# EAGLE schematic foxbms_bms-master_basic_v1.00 (EAGLE 6.5.0), part 2 of 2
## Sheet 22 of 22: Basic to Extension Connector
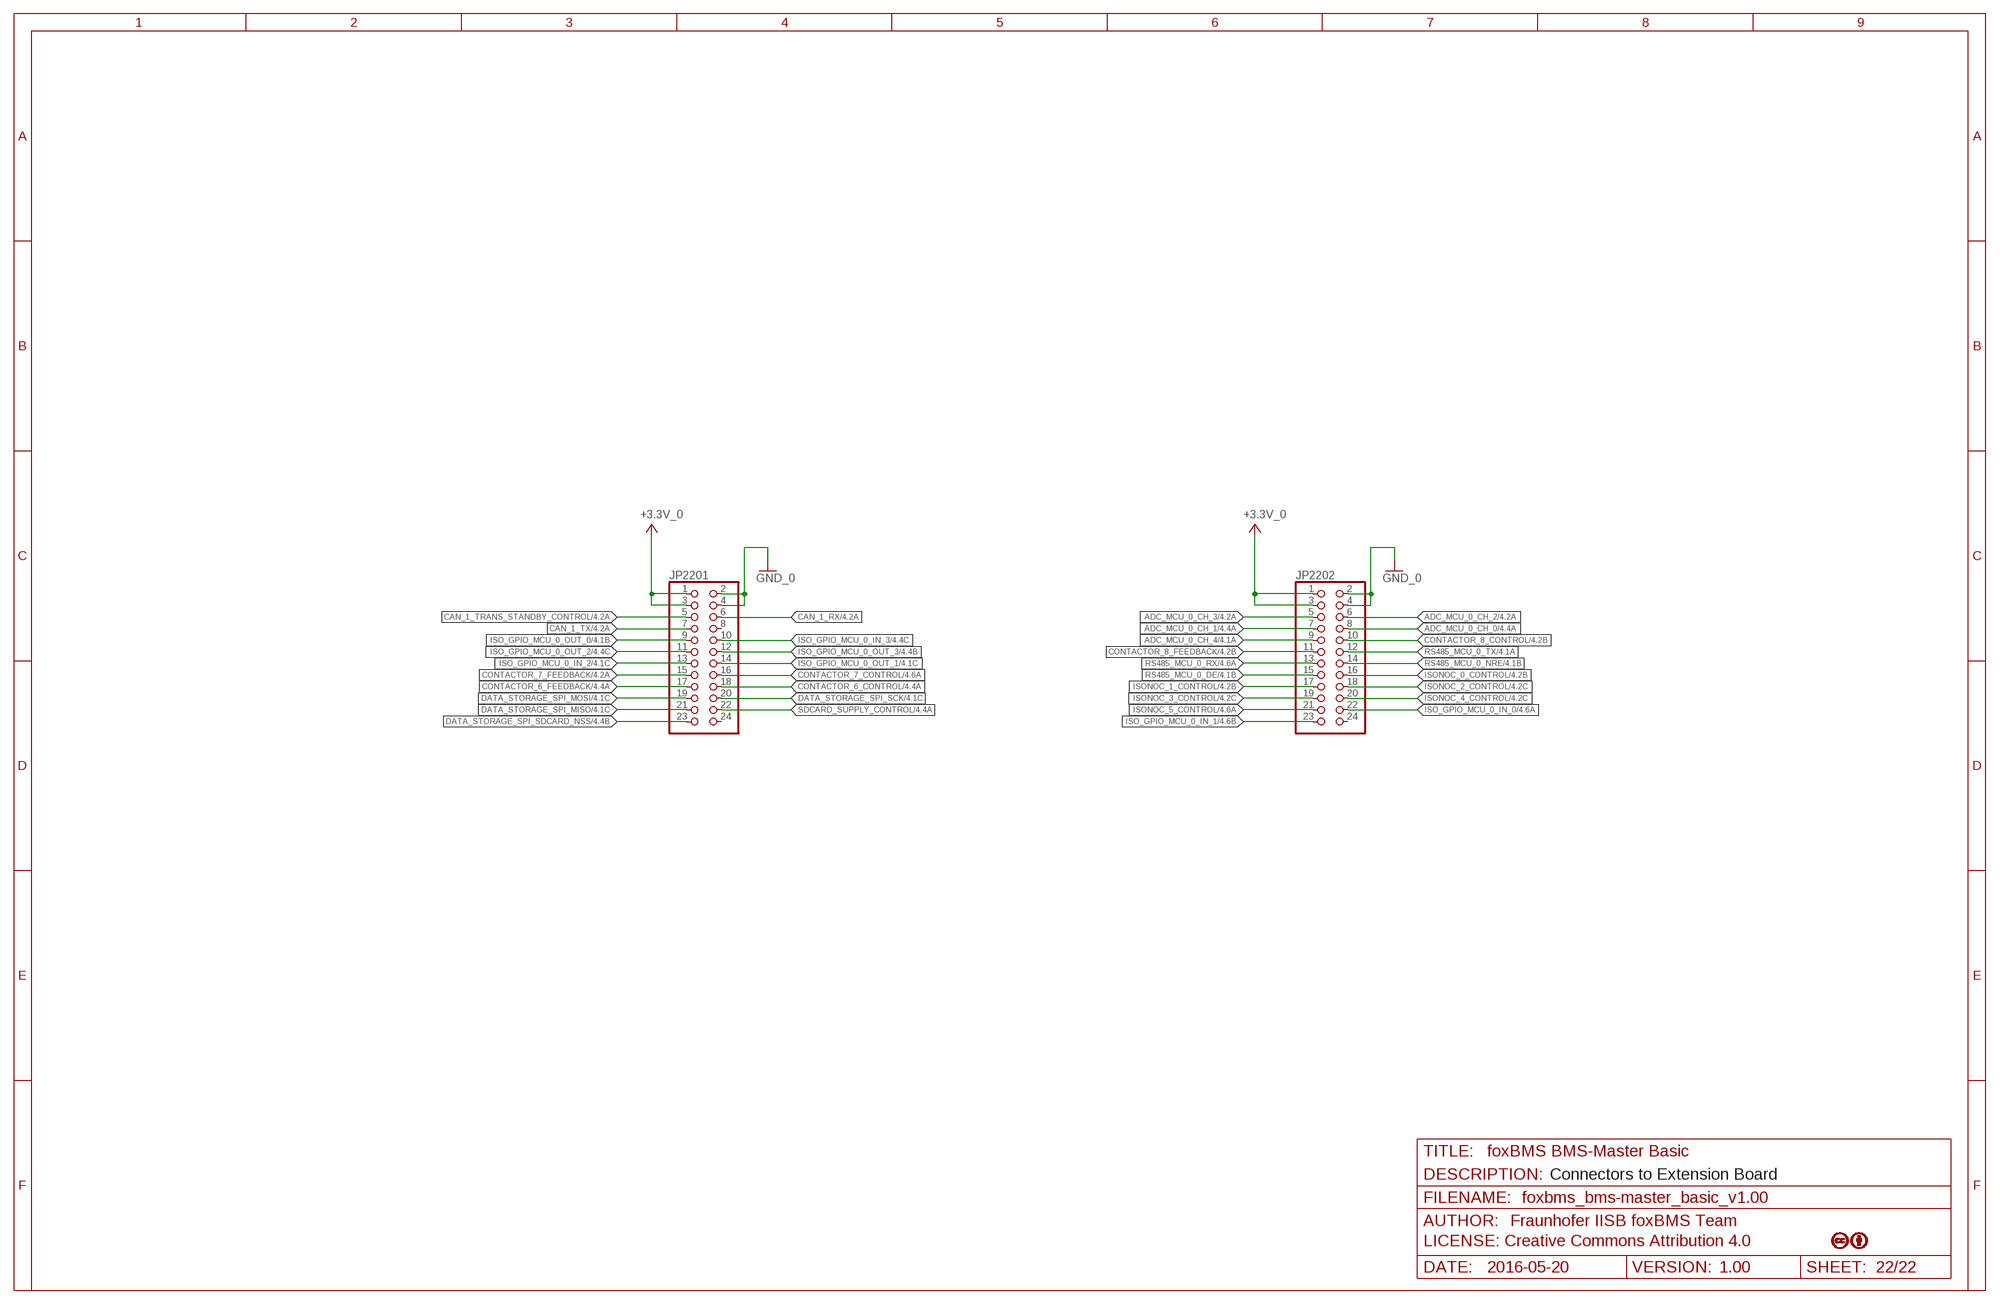
[diagram p21: schematic, sheet 22]

### Parts
JP2201  PINHD-2X12  [2X12]
JP2202  PINHD-2X12  [2X12]

### Nets
+3.3V_0: JP2201.1 JP2201.3 JP2202.1 JP2202.3 ; also sheet 2,4,6,7,8,9,10,11,14,15,16,18,21
ADC_MCU_0_CH_0: JP2202.8 ; also sheet 4
ADC_MCU_0_CH_1: JP2202.7 ; also sheet 4
ADC_MCU_0_CH_2: JP2202.6 ; also sheet 4
ADC_MCU_0_CH_3: JP2202.5 ; also sheet 4
ADC_MCU_0_CH_4: JP2202.9 ; also sheet 4
CAN_1_RX: JP2201.6 ; also sheet 4
CAN_1_TRANS_STANDBY_CONTROL: JP2201.5 ; also sheet 4
CAN_1_TX: JP2201.7 ; also sheet 4
CONTACTOR_6_CONTROL: JP2201.18 ; also sheet 4
CONTACTOR_6_FEEDBACK: JP2201.17 ; also sheet 4
CONTACTOR_7_CONTROL: JP2201.16 ; also sheet 4
CONTACTOR_7_FEEDBACK: JP2201.15 ; also sheet 4
CONTACTOR_8_CONTROL: JP2202.10 ; also sheet 4
CONTACTOR_8_FEEDBACK: JP2202.11 ; also sheet 4
DATA_STORAGE_SPI_MISO [controller]: JP2201.21 ; also sheet 4,15
DATA_STORAGE_SPI_MOSI [controller]: JP2201.19 ; also sheet 4,15
DATA_STORAGE_SPI_SCK [controller]: JP2201.20 ; also sheet 4,15
DATA_STORAGE_SPI_SDCARD_NSS: JP2201.23 ; also sheet 4
GND_0: JP2201.2 JP2201.4 JP2202.2 JP2202.4 ; also sheet 2,4,6,7,8,9,10,11,14,15,16,18,21
ISO_GPIO_MCU_0_IN_0: JP2202.22 ; also sheet 4
ISO_GPIO_MCU_0_IN_1: JP2202.23 ; also sheet 4
ISO_GPIO_MCU_0_IN_2: JP2201.13 ; also sheet 4
ISO_GPIO_MCU_0_IN_3: JP2201.10 ; also sheet 4
ISO_GPIO_MCU_0_OUT_0: JP2201.9 ; also sheet 4
ISO_GPIO_MCU_0_OUT_1: JP2201.14 ; also sheet 4
ISO_GPIO_MCU_0_OUT_2: JP2201.11 ; also sheet 4
ISO_GPIO_MCU_0_OUT_3: JP2201.12 ; also sheet 4
ISONOC_0_CONTROL: JP2202.16 ; also sheet 4
ISONOC_1_CONTROL: JP2202.17 ; also sheet 4
ISONOC_2_CONTROL: JP2202.18 ; also sheet 4
ISONOC_3_CONTROL: JP2202.19 ; also sheet 4
ISONOC_4_CONTROL: JP2202.20 ; also sheet 4
ISONOC_5_CONTROL: JP2202.21 ; also sheet 4
RS485_MCU_0_DE: JP2202.15 ; also sheet 4
RS485_MCU_0_NRE: JP2202.14 ; also sheet 4
RS485_MCU_0_RX: JP2202.13 ; also sheet 4
RS485_MCU_0_TX: JP2202.12 ; also sheet 4
SDCARD_SUPPLY_CONTROL: JP2201.22 ; also sheet 4
Unconnected: JP2201.8 JP2201.24 JP2202.24

### Notes on the sheet
- Connectors to Extension Board

## Library data of the parts
BATT = 0_LES_MECHANIK.SMD:SM?*: SM-Serie - Renata Batteries SMTU357-LF: Datasheet www Datasheet local SMTU1220-LF: Datasheet www Datasheet local SMTU1225-LF: Datasheet www Datasheet local Battery-Holder - Holder material: heat-resistant, glass fibre filled LCP Flammability rating UL 94 V-O - Battery contacts: spring stainless steel AISI 301, nickel-plated throughout. Solder area tin-plated throughout, min. thickness 5μm. - Contact resistance between contacts and the cell is less than 100 mΩ (measured through AC 1kHz; depending on the case material of the cell). - UL recognition, file E218732 - Operating temperature range: - 40/+100°C Revision Date changed by Changes ------------------------------------------------------------------------------------------ V1.0 08.12.2015 SC Ersterstellung; DISTRI_1: Farnell; DISTRI_1-NR: 1216353; DISTRI_1-PREIS: 1,52€; DISTRI_2: Mouser; DISTRI_2-NR: 614-SMTU1225-LF; DISTRI_2-PREIS: 0,864€; HERSTELLER: Renata; HERSTELLER-NR: SMTU1225-LF; MARKING: SMTU1225-LF; PDF-LOCAL: file:///C:\Eagle-Datasheet\Mechanik\SMTU1225-LF_Renata.pdf; SIZE: 23,70mm x 12,50mm x 4,80mm; UKAT: I; UTERM: Sn; UTMAX: 100°C; UTMIN: -40°C; UTYP: Battery Holder; UVAL: SMTU1225-LF
C201-C208 C301-C308 C401-C430 C501-C513 C601 C602 C701-C707 C901 C902 C1101-C1107 C1401-C1410 C1601-C1604 C1801-C1807 C2101 C2102 = rcl:C-EU: CAPACITOR, European symbol
C801-C807 C1501 = custom_passiv:C*: Kondensator Bitte gleich beim Einfügen vorgesehenen Werkstoff auswählen. 0402 NP0: #2759 0402 X7R: #1977 0402 Y5V: #2761 0603 X7R: #191 0603 Y5V: #497 0805 NP0: #74 0805 X7R: #104 1206 NP0: #102 1206 X7R: #98 1210 X7R: #114 1812 X7R: #335
D201 D301 = 0_LES_DIODE.SMD.SCHOTTKY:VS-10BQ*?: VS-10BQ Serie - Vishay VS-10BQ015-M3: Datasheet www Datasheet local VS-10BQ015HM3: Datasheet www Datasheet local VS-10BQ030-M3: Datasheet www Datasheet local VS-10BQ030HM3: Datasheet www Datasheet local VS-10BQ040-M3: Datasheet www Datasheet local VS-10BQ040HM3: Datasheet www Datasheet local VS-10BQ060-M3: Datasheet www Datasheet local VS-10BQ060HM3: Datasheet www Datasheet local VS-10BQ100-M3: Datasheet www Datasheet local VS-10BQ100HM3: Datasheet www Datasheet local High-Voltage Surface Mount Schottky Rectifier, 1A - Low forward voltage drop - Guard ring for enhanced ruggedness and long term reliability - Small foot print, surface mountable Revision Date changed by Changes ------------------------------------------------------------------------------------------ V1.0 21.04.2016 SC Ersterstellung; DISTRI_1: Mouser; DISTRI_1-NR: 78-VS-10BQ040-M35BT; DISTRI_1-PREIS: 0,398€; DISTRI_2: Digi-Key; DISTRI_2-NR: VS-10BQ040-M3/5BT-ND; DISTRI_2-PREIS: 0,405€; HERSTELLER: Vishay; HERSTELLER-NR: VS-10BQ040-M3; MARKING: 1F; PDF-LOCAL: file:///C:\Eagle-Datasheet\Dioden\VS-10BQ015-M3_Vishay.pdf; SIZE: SMB (DO-214AA); UIF: 1,00A; UKAT: I; UTERM: Sn; UTMAX: 175°C; UTMIN: -55°C; UTYP: Schottky; UVAL: VS-10BQ040-M3; UVR: 40,0V
D701 D702 = custom_diode:MM3Z_XVX_T1: MM3Z_xVx_T1 Series Zener Diode
D801 = 0_LES_TVS.SMD.ARRAY:PESD: DESD-Serie - NXP PESD1CAN-U: Datasheet www Datasheet local PESD1CAN: Datasheet www Datasheet local PESD1FLEX: Datasheet www Datasheet local PESD1IVN-U: Datasheet www Datasheet local PESD1LIN: Datasheet www Datasheet local PESD2CAN: Datasheet www Datasheet local PESD2IVN-U: Datasheet www Datasheet local TVS - Protection Diode - One very small SOT323 package to protect two CAN bus lines - Low clamping voltage VCL = 35 V at IPP = 1 A - Typical diode capacitance matching ΔCd/Cd = 0.1 % - ESD protection up to 23 kV; IEC 61000-4-2, level 4 - IEC 61000-4-5 (surge); IPPM = 3 A at tp = 8/20 μs - AEC-Q101 qualified Revision Date changed by Changes ------------------------------------------------------------------------------------------ V1.0 16.12.2015 SC Ersterstellung PESD1CAN-U V1.0 21.04.2016 SC Erstellung PESD1CAN; DISTRI_1: Farnell; DISTRI_1-NR: 1510703; DISTRI_1-PREIS: 0,086€; DISTRI_2: Mouser; DISTRI_2-NR: 771-PESD1CAN-T/R; DISTRI_2-PREIS: 0,416€; HERSTELLER: NXP; HERSTELLER-NR: PESD1CAN; MARKING: *AN; PDF-LOCAL: file:///C:\Eagle-Datasheet\TVS\PESD1CAN_NXP.pdf; SIZE: SOT23; UKAT: I; UTERM: Sn; UTMAX: 150°C; UTMIN: -55°C; UTYP: ESD Protection; UVAL: PESD1CAN; UVCC_MAX: 70,0V
D901 D902 = foxBMS_BMS-Master_V1.00_A:MM3Z_XVX_T1: MM3Z_xVx_T1 Series Zener Diode
D1001-D1006 = diode:GF1: DIODE
D1101-D1106 = 0_LES_TVS.SMD.ARRAY:CDSOD323-T*?: CDSOD323-TxxX - Bourns (unidirectional) Datasheet www Datasheet local Transient Voltage Suppressor Array diodes - Case: SOD323 - RoHS compliant* - Protects one line or one I/O port - Bidirectional configuration - ESD protection 30 kV max. - Low capacitance: ~3 pF typical - Replaces 0805 MLV devices Revision Date changed by Changes ------------------------------------------------------------------------------------------ V1.0 02.05.2016 SC Ersterstellung; HERSTELLER: BOURNS; HERSTELLER-NR: CDSOD323-T05; MARKING: 5; PDF-LOCAL: file:///C:/Eagle-Datasheet/TVS/CDSOD323-TxxC_Bourns.pdf; SIZE: SOD323 (SC-76); UID: 5,00uA; UKAT: I; UTERM: Sn; UTMAX: 150°C; UTMIN: -55°C; UTYP: TVS; UVAL: CDSOD323-T05; UVBR: 6,00V; UVCC: 5,00V
F1001-F1006 = 0_LES_SICHERUNG.SMD:*_UMT: UMT-Serie - Schurter Electronic Components Datasheet www Datasheet local Nicht Rückstellende Sicherung - 2-Pin OMT (11,00mm x 3,00mm x 3,00mm) Package - Nennspannung: 125 - 250VAC, 125 VDC - Nennstrom: 0.08 - 10A - Ausschaltvermögen: 35A - 200A - Charakteristik: Träge T - Montage: Leiterplatte,SMT - Zulässige Umgebungstemp: -55°C bis 125°C - Klimakategorie: 55/125/21 gemäss IEC 60068-1 - Material: Gehäuse Keramik - Material: Anschlüsse Kupferlegierung, verzinnt Revision Date changed by Changes ------------------------------------------------------------------------------------------ V1.0 20.01.2016 SC Ersterstellung; DISTRI_1: Reichelt; DISTRI_1-NR: UMT 0,63A; DISTRI_1-PREIS: 0,37€; DISTRI_2: Mouser; DISTRI_2-NR: 693-3403.0164.11; DISTRI_2-PREIS: 0,531€; HERSTELLER: Schurter; HERSTELLER-NR: 3403.0164.11; MARKING: T - 0,63A / AC 250V; PDF-LOCAL: file:///C:\Eagle-Datasheet\Sicherungen\UMT_250_Schurter.pdf; SIZE: 11,00mm x 3,00mm x 3,00mm; UIS_AC: 200A; UIS_DC: 200A; UKAT: I; UMAT: Keramik; UPV: 500mW; UTERM: Sn; UTMAX: 125°C; UTMIN: -55°C; UTOL: T; UTYP: Thin Film; UVAC: 250V; UVAL: 630mA; UVDC: 125V
IC201 IC301 = 0_LES_SPANNUNGSREGLER.SMD.LINEAR.EINZEL:LM1085I?*: LM1085 - Texas Instruments Datasheet www Datasheet local LM1085 3-A Low Dropout Positive Regulator - TO-263 / TO-220 - Package - Fully Specified for Operation Over −40°C to 125°C - Output Current in Excess of 3A - Available in 3.3-V, 5.0-V, 12-V and Adjustable Versions - Current Limiting and Thermal Protection - Line Regulation 0.015% (typical) - Load Regulation 0.1% (typical) Revision Date changed by Changes ------------------------------------------------------------------------------------------ V1.0 01.12.2015 SC Ersterstellung; DISTRI_1: Farnell; DISTRI_1-NR: 1469040; DISTRI_1-PREIS: 0,97€; DISTRI_2: Mouser; DISTRI_2-NR: 926-LM1085IS50NOPB; DISTRI_2-PREIS: 2,27€; HERSTELLER: Texas Instruments; HERSTELLER-NR: LM1085IS-5.0/NOPB; MARKING: LM1085IS-5.0; PDF-LOCAL: file:///C:\Eagle-Datasheet\Spannungsregler\LM1085_Texas_Instruments.pdf; SIZE: TO-263-3; UIOUT: 3,00A; UKAT: I; UTERM: Sn; UTMAX: 125°C; UTMIN: -40°C; UTYP: LDO-VTrack; UVAL: LM1085IS-5.0/NOPB; UVCC_MAX: 27,0V; UVCC_MIN: 2,60V; UVOUT: 5,00V
IC202 = 0_LES_SPANNUNGSWANDLER.TH.DC-DC.EINZEL.ISOLIERT:NCS6S*?: NCS6S - Serie - Murata Datasheet www Datasheet local - UL 60950 recognized - RoHS compliant - 4:1 Wide range voltage input - Operating temperature range –40°C to 85°C - Typical load regulation from 0.06% - 1.5kVDC Isolation - Typical efficiency to 87% - 12V & 48V Nominal input - Power density 0.94W/cm3 - UL 94V-0 Package materials - No electrolytic capacitors - Low noise - Under voltage lock out - Current fold back Revision Date changed by Changes ------------------------------------------------------------------------------------------ V1.0 25.04.2016 SC Ersterstellung; DISTRI_1: Mouser; DISTRI_1-NR: 580-NCS6S1205C; DISTRI_1-PREIS: 19,91€; HERSTELLER: Murata; HERSTELLER-NR: NCS6S1205C; MARKING: NCS6S1205C; PDF-LOCAL: file:///C:\Eagle-Datasheet\Spannungswandler\NCS6_Murata.pdf; SIZE: 32,00mm x 20,00mm x 10,00mm; UCISO: 225pF; UIOUT: 1,20A; UKAT: I; UP: 6,00W; URISO: 1,00GOhm; UTERM: Sn; UTMAX: 85°C; UTMIN: -40°C; UTYP: DC/DC Converter; UUIN_MAX: 36,0V; UUIN_MIN: 9,00V; UUIN_TYP: 12,0V; UUISO: 1,50kV; UUOUT: 5,00V; UVAL: NCS6S1205C
IC302 = 0_LES_SPANNUNGSWANDLER.TH.DC-DC.MULTI.ISOLIERT:RS-*D?: RS-*D - Serie - RECOM Power Datasheet www Datasheet local DC/DC Converter - 2Watt - SIP8 - Isolated - 2:1 and 4:1 Wide Input Voltage Ranges - 1kVDC, 2kVDC & 3kVDC Isolation - UL94V-0 Package Material - Continuous Short Circuit Protection - Low Noise - No External Capacitor needed - Efficiency to 83% Revision Date changed by Changes ------------------------------------------------------------------------------------------ V1.0 26.04.2016 SC Ersterstellung; DISTRI_1: Mouser; DISTRI_1-NR: 919-RS-2405D/H2; HERSTELLER: RECOM Power; HERSTELLER-NR: RS-2405D/H2; MARKING: RS-2405D/H2; PDF-LOCAL: file:///C:\Eagle-Datasheet\Spannungswandler\RS-S_D_Z_Recom_Power.pdf; SIZE: SIP8; UKAT: I; UTERM: Sn; UTMAX: 85°C; UTMIN: -40°C; UTYP: DC/DC Converter; UUISO: 1,00kV; UUOUT: ±5,00V; UVAL: RS-2405D/H2
IC401 = 0_LES_VREF.SMD.SERIELL:ADR34*: ADR34xx Serie - Analog Devices Datasheet www Datasheet local Micro-Power, High-Accuracy Voltage Reference - Initial accuracy: ±0.1% (maximum) - Maximum temperature coefficient: 8 ppm/°C - Operating temperature range: −40°C to +125°C - Output current: +10 mA source/−3 mA sink - Low quiescent current: 100 μA (maximum) - Low dropout voltage: 250 mV at 2 mA - Output noise (0.1 Hz to 10 Hz): <10 μV p-p at 1.2 V (typical) - 6-lead SOT-23 package - SOT23-6 Surface-Mounted Device (SMD) plastic package Revision Date changed by Changes ------------------------------------------------------------------------------------------ V1.0 10.12.2015 SC Ersterstellung; DISTRI_1: Farnell; DISTRI_1-NR: 2377039; DISTRI_1-PREIS: 1,91€; DISTRI_2: Mouser; DISTRI_2-NR: 584-ADR3425ARJZ-R7; DISTRI_2-PREIS: 2,34€; HERSTELLER: Analog Devices; HERSTELLER-NR: ADR3425ARJZ-R7; MARKING: R2X; PDF-LOCAL: file:///C:\Eagle-Datasheet\Referenzen\ADR3412_ADR3420_ADR3425_ADR3430_ADR3433_ADR3440_ADR3450_Analog_Devices.pdf; SIZE: SOT23-6; UKAT: I; UTERM: Sn; UTMAX: 125°C; UTMIN: -40°C; UTYP: V-REF; UVAL: ADR3425ARJZ-R7
IC402 = 0_LES_MCU.SMD.32BIT:STM32F429I*?: STM32F429xx - ST Microelectronic Datasheet www Datasheet local ARM Cortex-M4 32b MCU+FPU, 225DMIPS, up to 2MB Flash/256+4KB RAM, USB OTG HS/FS, Ethernet, 17 TIMs, 3 ADCs, 20 comm. interfaces, camera & LCD-TFT: -Core: ARM® 32-bit Cortex®-M4 CPU with FPU, Adaptive real-time accelerator (ART Accelerator™) allowing 0-wait state execution from Flash memory, frequency up to 180 MHz, MPU, 225 DMIPS/1.25 DMIPS/MHz (Dhrystone 2.1), and DSP instructions • Memories – Up to 2 MB of Flash memory organized into two banks allowing read-while-write – Up to 256+4 KB of SRAM including 64-KB of CCM (core coupled memory) data RAM – Flexible external memory controller with up to 32-bit data bus: SRAM,PSRAM,SDRAM/LPSDR SDRAM, Compact Flash/NOR/NAND memories • LCD parallel interface, 8080/6800 modes • LCD-TFT controller up to XGA resolution with dedicated Chrom-ART Accelerator™ for enhanced graphic content creation (DMA2D) • Clock, reset and supply management – 1.7 V to 3.6 V application supply and I/Os – POR, PDR, PVD and BOR – 4-to-26 MHz crystal oscillator – Internal 16 MHz factory-trimmed RC (1% accuracy) – 32 kHz oscillator for RTC with calibration – Internal 32 kHz RC with calibration • Low power – Sleep, Stop and Standby modes – VBAT supply for RTC, 20×32 bit backup registers + optional 4 KB backup SRAM • 3×12-bit, 2.4 MSPS ADC: up to 24 channels and 7.2 MSPS in triple interleaved mode • 2×12-bit D/A converters • General-purpose DMA: 16-stream DMA controller with FIFOs and burst support • Up to 17 timers: up to twelve 16-bit and two 32-bit timers up to 180 MHz, each with up to 4 IC/OC/PWM or pulse counter and quadrature (incremental) encoder input • Debug mode – SWD & JTAG interfaces – Cortex-M4 Trace Macrocell™ Revision Date changed by Changes ------------------------------------------------------------------------------------------ V1.0 11.01.2016 SC Ersterstellung; DISTRI_1: Farnell; DISTRI_1-NR: 2393656; DISTRI_1-PREIS: 10,56€; DISTRI_2: Mouser; DISTRI_2-NR: 511-STM32F429IIT6; DISTRI_2-PREIS: 16,92€; HERSTELLER: ST Microelectronics; HERSTELLER-NR: STM32F429IIT6; MARKING: E32F429IIT6; PDF-LOCAL: file:///C:\Eagle-Datasheet\Microcontroller\STM32F429_ST.pdf; UFREQ: 180 MHz; UIO: 82; UKAT: I; ULFS: Lead Free; UPACKAGE: LQFP-176; UPS: 2,00 MB; URAM: 256 kB; UTERM: Sn; UTMAX: 85°C; UTMIN: -40°C; UTYP: Microcontroller; UVAL: STM32F429IIT6; UVCC_MIN: 1,80V; VCC_MAX: 3,60V
IC501 = 0_LES_MCU.SMD.32BIT:STM32F429V*?: STM32F429xx - ST Microelectronic Datasheet www Datasheet local ARM Cortex-M4 32b MCU+FPU, 225DMIPS, up to 2MB Flash/256+4KB RAM, USB OTG HS/FS, Ethernet, 17 TIMs, 3 ADCs, 20 comm. interfaces, camera & LCD-TFT: -Core: ARM® 32-bit Cortex®-M4 CPU with FPU, Adaptive real-time accelerator (ART Accelerator™) allowing 0-wait state execution from Flash memory, frequency up to 180 MHz, MPU, 225 DMIPS/1.25 DMIPS/MHz (Dhrystone 2.1), and DSP instructions • Memories – Up to 2 MB of Flash memory organized into two banks allowing read-while-write – Up to 256+4 KB of SRAM including 64-KB of CCM (core coupled memory) data RAM – Flexible external memory controller with up to 32-bit data bus: SRAM,PSRAM,SDRAM/LPSDR SDRAM, Compact Flash/NOR/NAND memories • LCD parallel interface, 8080/6800 modes • LCD-TFT controller up to XGA resolution with dedicated Chrom-ART Accelerator™ for enhanced graphic content creation (DMA2D) • Clock, reset and supply management – 1.7 V to 3.6 V application supply and I/Os – POR, PDR, PVD and BOR – 4-to-26 MHz crystal oscillator – Internal 16 MHz factory-trimmed RC (1% accuracy) – 32 kHz oscillator for RTC with calibration – Internal 32 kHz RC with calibration • Low power – Sleep, Stop and Standby modes – VBAT supply for RTC, 20×32 bit backup registers + optional 4 KB backup SRAM • 3×12-bit, 2.4 MSPS ADC: up to 24 channels and 7.2 MSPS in triple interleaved mode • 2×12-bit D/A converters • General-purpose DMA: 16-stream DMA controller with FIFOs and burst support • Up to 17 timers: up to twelve 16-bit and two 32-bit timers up to 180 MHz, each with up to 4 IC/OC/PWM or pulse counter and quadrature (incremental) encoder input • Debug mode – SWD & JTAG interfaces – Cortex-M4 Trace Macrocell™ Revision Date changed by Changes ------------------------------------------------------------------------------------------ V1.0 11.01.2016 SC Ersterstellung; DISTRI_1: Farnell; DISTRI_1-NR: 2393659; DISTRI_1-PREIS: 8,24€; DISTRI_2: Mouser; DISTRI_2-NR: 511-STM32F429VIT6; DISTRI_2-PREIS: 15,39€; HERSTELLER: ST Microelectronics; HERSTELLER-NR: STM32F429VIT6; MARKING: E32F429VIT6; PDF-LOCAL: file:///C:\Eagle-Datasheet\Microcontroller\STM32F429_ST.pdf; UFREQ: 180 MHz; UIO: 82; UKAT: I; ULFS: Lead Free; UPACKAGE: LQFP-100; UPS: 2,00 MB; URAM: 256 kB; UTERM: Sn; UTMAX: 85°C; UTMIN: -40°C; UTYP: Microcontroller; UVAL: STM32F429VIT6; UVCC_MIN: 1,80V; VCC_MAX: 3,60V
IC601 IC1403 IC1406 = 0_LES_SCHNITTSTELLEN-IC.SMD.ISOLATOR:ADUM1401: ADUM1401 - Analog Devices Datasheet www Datasheet local Quad-Channel Digital Isolator - Qualified for automotive applications - Low power operation - 5 V operation: - 1.0 mA per channel maximum at 0 Mbps to 2 Mbps - 3.5 mA per channel maximum at 10 Mbps - 31 mA per channel maximum at 90 Mbps - 3 V operation: - 0.7 mA per channel maximum at 0 Mbps to 2 Mbps - 2.1 mA per channel maximum at 10 Mbps - 20 mA per channel maximum at 90 Mbps - Bidirectional communication - 3 V/5 V level translation - High temperature operation: 125°C - High data rate: dc to 90 Mbps (NRZ) - Precise timing characteristics: - 2 ns maximum pulse width distortion - 2 ns maximum channel-to-channel matching - High common-mode transient immunity: >25 kV/μs - Output enable function - 16-lead SOIC wide body package Revision Date changed by Changes ------------------------------------------------------------------------------------------ V1.0 28.10.2015 SC Ersterstellung; DISTRI_1: Digi-Key; DISTRI_1-NR: ADUM1401ARW-ND; DISTRI_1-PREIS: 5,08€; DISTRI_2: Mouser; DISTRI_2-NR: 584-ADUM1401ARW; DISTRI_2-PREIS: 3,92€; HERSTELLER: Analog Devices; HERSTELLER-NR: ADUM1401ARW; MARKING: ADUM1401ARW; PDF-LOCAL: file:///C:\Eagle-Datasheet\Schnittstellen-IC\ADuM1400_1401_1402_Linear.pdf; SIZE: SOIC-16; UDR: 1,00Mbps; UDT: 100ns; UKAT: I; UPWV: 40,0ns; UTERM: Sn; UTMAX: 105°C; UTMIN: -40°C; UTYP: Digital Isolator; UVAL: ADUM1401ARW; UVDD_MAX: 5,50V; UVDD_MIN: 2,70V
IC701 IC1101 = 0_LES_SPANNUNGSREGLER.SMD.LINEAR.EINZEL:UA78L*?: UA78Lxx - Fairchild Semiconductor Datasheet www Datasheet local μA78L00 Series Positive-Voltage Regulators - TO-220 / D-PAK - Package - 3-Terminal Regulators - Output Current up to 100 mA - No External Components - Internal Thermal-Overload Protection - Internal Short-Circuit Current Limiting Revision Date changed by Changes ------------------------------------------------------------------------------------------ V1.0 01.12.2015 SC Ersterstellung; DISTRI_1: Farnell; DISTRI_1-NR: 2437928; DISTRI_1-PREIS: 0,3158€; DISTRI_2: Mouser; DISTRI_2-NR: 595-UA78L05ACPK; DISTRI_2-PREIS: 0,507; HERSTELLER: Texas Instruments; HERSTELLER-NR: UA78L05ACPK; MARKING: UA78L05AC; PDF-LOCAL: file:///C:\Eagle-Datasheet\Spannungsregler\UA78L00_Texas_Instruments.pdf; SIZE: SOT-89; UIOUT: 100mA; UKAT: I; UTERM: Sn; UTMAX: 125°C; UTMIN: -40°C; UTYP: LDO-VTrack; UVAL: UA78L05ACPK; UVCC_MAX: 20,0V; UVCC_MIN: 7,00V; UVOUT: 5,00V
IC702 = 0_LES_SCHNITTSTELLEN-IC.SMD.ISOLATOR:ADUM1301: ADUM1301 - Analog Devices Datasheet www Datasheet local Triple-Channel Digital Isolator - Qualified for automotive applications - Low power operation - 5 V operation: - 1.2 mA per channel maximum at 0 Mbps to 2 Mbps - 3.5 mA per channel maximum at 10 Mbps - 32 mA per channel maximum at 90 Mbps - 3 V operation: - 0.8 mA per channel maximum at 0 Mbps to 2 Mbps - 2.2 mA per channel maximum at 10 Mbps - 20 mA per channel maximum at 90 Mbps - Bidirectional communication - 3 V/5 V level translation - High temperature operation: 125°C - High data rate: dc to 90 Mbps (NRZ) - Precise timing characteristics: - 2 ns maximum pulse width distortion - 2 ns maximum channel-to-channel matching - High common-mode transient immunity: >25 kV/μs - Output enable function - 16-lead SOIC wide body package Revision Date changed by Changes ------------------------------------------------------------------------------------------ V1.0 28.10.2015 SC Ersterstellung; DISTRI_1: Digi-Key; DISTRI_1-NR: ADUM1301ARW-ND; DISTRI_1-PREIS: 4,22€; DISTRI_2: Mouser; DISTRI_2-NR: 584-ADUM1301ARW; DISTRI_2-PREIS: 4,29€; HERSTELLER: Analog Devices; HERSTELLER-NR: ADUM1301ARW; MARKING: ADUM1301ARW; PDF-LOCAL: file:///C:\Eagle-Datasheet\Schnittstellen-IC\ADuM1300_1301_Linear.pdf; SIZE: SOIC-16; UDR: 1,00Mbps; UDT: 100ns; UKAT: I; UPWV: 40,0ns; UTERM: Sn; UTMAX: 105°C; UTMIN: -40°C; UTYP: Digital Isolator; UVAL: ADUM1301ARW; UVDD_MAX: 5,50V; UVDD_MIN: 2,70V
IC801 = 0_LES_SPANNUNGSREGLER.SMD.LINEAR.EINZEL:KA78*E: KA78xx - Fairchild Semiconductor Datasheet www Datasheet local 3-Terminal 1A Positive Voltage Regulator - TO-220 / D-PAK - Package - Output current up to 1A - Output voltages of 5, 6, 8, 9, 12, 15, 18, 24V - Thermal overload protection - Short circuit protection - Output transistor safe operating area protection Revision Date changed by Changes ------------------------------------------------------------------------------------------ V1.0 30.11.2015 SC Ersterstellung; DISTRI_1: Farnell; DISTRI_1-NR: 2102585; DISTRI_1-PREIS: 0,3158€; DISTRI_2: Mouser; DISTRI_2-NR: 512-KA7805ERTF; DISTRI_2-PREIS: 0,704€; HERSTELLER: Fairchild Semiconductor; HERSTELLER-NR: KA7805ERTF; MARKING: KA7805E; PDF-LOCAL: file:///C:\Eagle-Datasheet\Spannungsregler\KA7805E_Fairchild.pdf; SIZE: TO-252 (D-PAK); UIOUT: 1,00A; UKAT: I; UTERM: Sn; UTMAX: 125°C; UTMIN: -40°C; UTYP: LDO-VTrack; UVAL: KA7805ERTF; UVCC_MAX: 35,0V; UVCC_MIN: 11,5V; UVOUT: 5,00V
IC802 = 0_LES_SCHNITTSTELLEN-IC.SMD.CAN-TRANSCEIVER:TJA1052: TJA1052IT/5Y - NXP Datasheet www Datasheet local Schnittstellen-IC - CAN-Treiber - Isolator and Transceiver integrated into a single SO16 package, reducing board space - Flawless cooperation between the Isolator and the Transceiver - Fewer components improves reliability in applications - Guaranteed performance (eg. max loop delay <220 ns) - Electrical transient immunity of 45 kV/µs (typ) - ISO 11898-2 compliant - Up to 5 kV (RMS) rated isolation - Three versions available (1 kV, 2.5 kV and 5 kV) - Voltage compliant with UL 1577 (pending), IEC 61010 and IEC 60950 - 5 kV (RMS) rated isolation voltage compliant with UL 1577, IEC 61010 and IEC 60950 - Supports ISO6469 ‘Electrically propelled road vehicles. Safety specifications.’ - High ESD handling capability on the bus pins - Bus pins protected against transients in automotive environments - Transmit Data (TXD) dominant time-out function - Undervoltage detection on supply pins Revision Date changed by Changes ------------------------------------------------------------------------------------------ V1.0 03.12.2015 SC Ersterstellung; DISTRI_1: Digi-Key; DISTRI_1-NR: TJA1052IT/1Y-ND; DISTRI_1-PREIS: 3,66€; DISTRI_2: Mouser; DISTRI_2-NR: 771-TJA1052IT/1Y; DISTRI_2-PREIS: 4,86€; HERSTELLER: NXP; HERSTELLER-NR: TJA1052IT/1Y; MARKING: TJA1052IT/1Y; PDF-LOCAL: file:///C:\Eagle-Datasheet\Schnittstellen-IC\TJA1052I_NXP.pdf; SIZE: SO-16; UKAT: I; UTERM: Sn; UTMAX: 125°C; UTMIN: -55°C; UTYP: CAN Transceiver; UVAL: TJA1052IT/1Y; UVCC_MAX: 5,25V; UVCC_MIN: 3,00V
IC803 IC902-IC905 = 0_LES_RELAIS.SMD:CPC1008N: CPC1008N - IXYS Datasheet www Datasheet local Single-Pole, Normally Open - OptoMOS® Relay - SOP-4 - Package - 1500Vrms Input/Output Isolation - Small 4-Pin SOP Package - Low Drive Power Requirements - High Reliability - Arc-Free With No Snubbing Circuits - No EMI/RFI Generation - Wave Solderable - Tape & Reel Version Available Revision Date changed by Changes ------------------------------------------------------------------------------------------ V1.0 01.12.2015 SC Ersterstellung; DISTRI_1: Farnell; DISTRI_1-NR: 2435796; DISTRI_1-PREIS: 1,09€; DISTRI_2: Mouser; DISTRI_2-NR: 926-LM1085ISXADJNOPB; DISTRI_2-PREIS: 1,89€; HERSTELLER: IXYS; HERSTELLER-NR: CPC1008N; MARKING: CPC1008N; PDF-LOCAL: file:///C:\Eagle-Datasheet\Relais\CPC1008N_IXYS.pdf; SIZE: SOP-4; UKAT: I; UPV: 400mW; URISO: 1,50kV; UTERM: Sn; UTMAX: 85°C; UTMIN: -40°C; UTYP: LDO-VTrack; UVAL: CPC1008N
IC901 = 0_LES_SPANNUNGSREGLER.SMD.LINEAR.EINZEL:*317M?: *317Mxx - ON Semiconductor Datasheet www Datasheet local Positive Linear Voltage Regulator, Adjustable Output, 500 mA - TO-220 / D-PAK / SOT-223 - Package - 3-Terminal Regulators - Output Current in Excess of 500 mA - Output Adjustable between 1.2 V and 37 V - Internal Thermal Overload Protection - Internal Short Circuit Current Limiting - Output Transistor Safe-Area Compensation - Floating Operation for High Voltage Applications - Eliminates Stocking Many Fixed Voltages - Pb-Free Packages are Available - NCV Prefix for Automotive and Other Applications Requiring Site Control Changes Revision Date changed by Changes ------------------------------------------------------------------------------------------ V1.0 01.12.2015 SC Ersterstellung; DISTRI_1: Farnell; DISTRI_1-NR: 1652292; DISTRI_1-PREIS: 0,425€; DISTRI_2: Mouser; DISTRI_2-NR: 863-LM317MBSTT3G; DISTRI_2-PREIS: 0,796€; HERSTELLER: ON Semiconductor; HERSTELLER-NR: LM317MBSTT3G; MARKING: 317MB; PDF-LOCAL: file:///C:\Eagle-Datasheet\Spannungsregler\LM317M_ON Semiconductor.pdf; SIZE: SOT-223; UIOUT: 500mA; UKAT: I; UTERM: Sn; UTMAX: 125°C; UTMIN: -40°C; UTYP: LDO-VTrack; UVAL: LM317MBSTT3G; UVCC_MAX: 40,0V; UVCC_MIN: 4,20V; UVOUT_MAX: 37,0V; UVOUT_MIN: 1,20V
IC1001-IC1006 = 0_LES_RELAIS.SMD:AQV25*?: AQV25 Serie - Panasonic Datasheet www Datasheet local Miniature SOP6-pin type with high capacity of 3A load current - SOP-6 - Package - High capacity in a miniature SOP package Continuous load current: Max. 3A Load voltage: 50V and 80V - Greatly improved specifications allow you to use this in place of mercury and mechanical relays. Revision Date changed by Changes ------------------------------------------------------------------------------------------ V1.0 21.04.2016 SC Ersterstellung; DISTRI_1: Digi-Key; DISTRI_1-NR: 255-3594-1-ND; DISTRI_1-PREIS: 7,94€; DISTRI_2: Mouser; DISTRI_2-NR: 769-AQV252G2SX; DISTRI_2-PREIS: 10,20€; HERSTELLER: Panasonic; HERSTELLER-NR: AQV252G2S; MARKING: AQV252G2S; PDF-LOCAL: file:///C:\Eagle-Datasheet\Relais\AQV252G2_Panasonic.pdf; SIZE: SOP-6; UIF: 50,0mA; UIL: 3,00A; UKAT: I; UPV: 500mW; URISO: 1,50kV; UTERM: Sn; UTMAX: 85°C; UTMIN: -40°C; UTYP: Relay; UVAL: AQV252G2S; UVL: 50,0V
IC1102 IC1103 = 0_LES_SCHNITTSTELLEN-IC.SMD.ISOLATOR:ADUM1300: ADUM1300 - Analog Devices Datasheet www Datasheet local Triple-Channel Digital Isolator - Qualified for automotive applications - Low power operation - 5 V operation: - 1.2 mA per channel maximum at 0 Mbps to 2 Mbps - 3.5 mA per channel maximum at 10 Mbps - 32 mA per channel maximum at 90 Mbps - 3 V operation: - 0.8 mA per channel maximum at 0 Mbps to 2 Mbps - 2.2 mA per channel maximum at 10 Mbps - 20 mA per channel maximum at 90 Mbps - Bidirectional communication - 3 V/5 V level translation - High temperature operation: 125°C - High data rate: dc to 90 Mbps (NRZ) - Precise timing characteristics: - 2 ns maximum pulse width distortion - 2 ns maximum channel-to-channel matching - High common-mode transient immunity: >25 kV/μs - Output enable function - 16-lead SOIC wide body package Revision Date changed by Changes ------------------------------------------------------------------------------------------ V1.0 27.10.2015 SC Ersterstellung; DISTRI_1: Digi-Key; DISTRI_1-NR: ADUM1300ARW-ND; DISTRI_1-PREIS: 3,58€; HERSTELLER: Analog Devices; HERSTELLER-NR: ADUM1300ARW; MARKING: ADUM1300ARW; PDF-LOCAL: file:///C:\Eagle-Datasheet\Schnittstellen-IC\ADuM1300_1301_Linear.pdf; SIZE: SOIC-16; UDR: 1,00Mbps; UDT: 100ns; UKAT: I; UPWV: 40,0ns; UTERM: Sn; UTMAX: 105°C; UTMIN: -40°C; UTYP: Digital Isolator; UVAL: ADUM1300ARW; UVDD_MAX: 5,50V; UVDD_MIN: 2,70V
IC1401 IC1404 = 0_LES_TVS.SMD.ARRAY:IP4220CZ6: IP4220CZ6 - NXP Datasheet www Datasheet local Dual USB 2.0 integrated ESD protection - Pb-free, Restriction of Hazardous Substances (RoHS) compliant and free of halogen and antimony (Dark Green compliant) - ESD protection up to 8 kV contact discharge; IEC 61000-4-2, level 4 compliant - Four pairs of ultra low input capacitance (CI = 1 pF) ESD rail-to-rail protection diodes - Low voltage clamping due to integrated Zener diode - Small 6-lead TSOP6 (SOT457) SMD package Revision Date changed by Changes ------------------------------------------------------------------------------------------ V1.0 08.12.2015 SC Ersterstellung; DISTRI_1: Farnell; DISTRI_1-NR: 1506629; DISTRI_1-PREIS: 0,104€; DISTRI_2: Mouser; DISTRI_2-NR: 771-IP4220CZ6-T/R; DISTRI_2-PREIS: 0,416€; HERSTELLER: NXP; HERSTELLER-NR: IP4220CZ6; MARKING: 20; PDF-LOCAL: file:///C:\Eagle-Datasheet\TVS\IP4220CZ6_NXP.pdf; SIZE: TSOP-6; UKAT: I; UTERM: Sn; UTMAX: 125°C; UTMIN: -55°C; UTYP: ESD Protection; UVAL: IP4220CZ6; UVCC_MAX: 5,50V; UVCC_MIN: 0,70V
IC1402 IC1405 = 0_LES_SCHNITTSTELLEN-IC.SMD.USB-TRANSCEIVER:FT231X?-*: FT231X?-* - FTDI Datasheet www Datasheet local Schnittstellen-IC - Full Speed USB to Full Handshake UART - Single chip USB to asynchronous serial data transfer interface. - Entire USB protocol handled on the chip. No USB specific firmware programming required. - Fully integrated 2048 byte EEPROM for storing device descriptors and CBUS I/O configuration. - Fully integrated clock generation with no external crystal required plus - optional clock output selection enabling a glue-less interface to external MCU or FPGA. - Data transfer rates from 300 baud to 3 Mbaud. - 512 byte receive buffer and 512 byte transmit buffer utilising buffer smoothing technology to allow for high data throughput. - FTDI’s royalty-free Virtual Com Port (VCP) and Direct (D2XX) drivers eliminate the requirement for USB driver development in most cases. - Configurable CBUS I/O pins. - Transmit and receive LED drive signals. - UART interface support for 7 or 8 data bits, 1 or 2 stop bits and odd / even / mark / space / no parity - Synchronous and asynchronous bit bang interface options with RD# and WR# strobes. - Battery Charger Detection. May be used by mobile devices to detect the presence of a charger on the USB port to enable higher current / faster charging of batteries. - Device supplied pre-programmed with unique USB serial number. - Supports bus powered, self powered and high-power bus powered USB configurations. - Integrated +3.3V level converter for USB I/O. - True 3.3V CMOS drive output and TTL input. (operates down to 1V8 with external pull ups and is also 5V tolerant) - Configurable I/O pin output drive strength. - Integrated power-on-reset circuit. - UART signal inversion option. - Internal 3.3V/1.8V LDO regulators - Low operating current of 8mA (typical) and USB suspend current of 125uA (typical) current. - Low USB bandwidth consumption. - UHCI/OHCI/EHCI host controller compatible. - USB 2.0 Full Speed compatible. - Extended operating temperature range: -40°C to 85°C - Available in compact Pb-free 20 Pin SSOP and QFN packages (both RoHS compliant). Revision Date changed by Changes ------------------------------------------------------------------------------------------ V1.0 21.01.2016 SC Ersterstellung; DISTRI_1: Mouser; DISTRI_1-NR: 895-FT231XS-R; DISTRI_1-PREIS: 1,94€; DISTRI_2: Digi-Key; DISTRI_2-NR: 768-1129-1-ND; DISTRI_2-PREIS: 2,29€; HERSTELLER: FTDI; HERSTELLER-NR: FT231XSR; MARKING: FT231XS; PDF-LOCAL: file:///C:\Eagle-Datasheet\Schnittstellen-IC\FT231X-13571_FTDI.pdf; SIZE: SSOP-20; UKAT: I; UTERM: Sn; UTMAX: 85°C; UTMIN: -40°C; UTYP: USB Transceiver; UVAL: FT231XS-R; UVCC_MAX: 5,00V; UVCC_MIN: 3,30V
IC1501 = 0_LES_SPEICHER.SMD.EEPROM:AT25*B-?: AT25128B-SSHL-T - Atmel Datasheet www Datasheet local SPI Serial EEPROM 128K (16,384 x 8), 256K (32,768 x 8) - Serial Peripheral Interface (SPI) Compatible - Supports SPI Modes 0 (0,0) and 3 (1,1) - Data Sheet Describes Mode 0 Operation - Low-voltage and Standard-voltage Operation - VCC = 1.8V to 5.5V - 20MHz Clock Rate (5V) - 64-byte Page Mode and Byte Write Operation - Block Write Protection - Protect 1/4, 1/2, or Entire Array - Write Protect (WP) Pin and Write Disable Instructions for Both Hardware and Software Data Protection - Self-timed Write Cycle (5ms max) - High Reliability - Endurance: 1,000,000 Write Cycles - Data Retention: 100 Years - Green (Pb/Halogen-free/RoHS Compliant) Packaging Options - Die Sales: Wafer Form, Waffle Pack, and Bumped Wafers Revision Date changed by Changes ------------------------------------------------------------------------------------------ V1.0 11.01.2015 SC Ersterstellung; DISTRI_1: Farnell; DISTRI_1-NR: 2345601; DISTRI_1-PREIS: 0,86€; DISTRI_2: Mouser; DISTRI_2-NR: 556-AT25128B-SSHL-T; DISTRI_2-PREIS: 1,02€; HERSTELLER: Atmel; HERSTELLER-NR: AT25128B-SSHL-T; MARKING: AT25128B-SSHL; PDF-LOCAL: file:///C:\Eagle-Datasheet\Speicher\IS42S16400J-7TLI_ISSI.pdf; SIZE: SOIC-8; UFREQ: 20,0MHz; UKAT: I; UPS: 128 Kbit; UTERM: Sn; UTMAX: 85°C; UTMIN: -40°C; UTYP: EEPROM; UVAL: AT25128B-SSHL-T; UVCC_MAX: 5,50V; UVCC_MIN: 1,80V
IC1801 = 0_LES_SPEICHER.SMD.SDRAM:IS4*S16400J-: IS42S16400J / IS45S16400J - Integrated Silicon Solution Incorporated Datasheet www Datasheet local 1 Meg Bits x 16 Bits x 4 Banks (64-MBIT) SYNCHRONOUS DYNAMIC RAM - Clock frequency: 200, 166, 143, 133 MHz - Fully synchronous; all signals referenced to a positive clock edge - Internal bank for hiding row access/precharge - Single 3.3V power supply - LVTTL interface - Programmable burst length – (1, 2, 4, 8, full page) - Programmable burst sequence: Sequential/Interleave - Self refresh modes - Auto refresh (CBR) - 4096 refresh cycles every 64 ms (Com, Ind, A1 grade) or 16ms (A2 grade) - Random column address every clock cycle - Programmable CAS latency (2, 3 clocks) - Burst read/write and burst read/single write operations capability - Burst termination by burst stop and precharge command Revision Date changed by Changes ------------------------------------------------------------------------------------------ V1.0 09.12.2015 SC Ersterstellung; DISTRI_1: Digi-Key; DISTRI_1-NR: IS42S16400J-5TL-ND; DISTRI_1-PREIS: 2,31€; DISTRI_2: Mouser; DISTRI_2-NR: 870-IS42S16400J-5TL; DISTRI_2-PREIS: 3,13€; HERSTELLER: ISSI; HERSTELLER-NR: IS42S16400J-5TL; MARKING: IS42S16400J-5TL; PDF-LOCAL: file:///C:\Eagle-Datasheet\Speicher\IS42S16400J-7TLI_ISSI.pdf; SIZE: TSOP-II; UFREQ: 200MHz; UKAT: C; UTERM: Sn; UTMAX: 70°C; UTMIN: 0°C; UTYP: SDRAM; UVAL: IS42S16400J-5TL
JP2201 JP2202 = foxBMS_BMS-Master_BasicBoard_V1.02_A:PINHD-2X12: PIN HEADER
L401 = foxBMS_BMS-Master_V1.00_A:L*: einfache Induktivität 0402: #2763 1206: #641 1210: #609 HT_SIMID_1210: #2161 SIMID_1210: #355 H1210: #631 H_SIMID1210: #473 2220: #457 H_2220: #467 _N05DB: #515 _NP05DB: #779 _330/EH: #1196 _B166: #653 _B179: #655 _BC: #603 _BC0824: #619 _BC0826: #615 _LBC: #607 _WE-FI_22MYH: #623 _WE-FI_1.8MYH: #611 _WE-FI_10MYH: #613 _BLM11A102S: #2063 _BLM11A121S: #2079 WE_PD4_X: #44 DR127: #514 _WE_744318180: #520
L801 = 0_LES_INDUKTIVITAET.SMD.FILTER.HF:B82789: B82789C0/S0 - Serie - Epcos Datasheet www Datasheet local B82789C0/S0 - Serie - Epcos - Stromkompensierte Drosseln für CANBUS - Bauform:1812 - Betriebstemperatur: –50ºC bis +125ºC/+155°C - Betriebsspannung: 80 VDC (42 VAC) - Empfohlenes Lötverfahren: Reflow Revision Date changed by Changes ------------------------------------------------------------------------------------------ V1.0 26.10.2015 SC Ersterstellung; DISTRI_1: Mouser; DISTRI_1-NR: 871-B82789C0513H001; HERSTELLER: EPCOS; HERSTELLER-NR: B82789C0513H001; MARKING: B82789C0/S0; PDF-LOCAL: file:///C:\Eagle-Datasheet\Induktivitaet\B82789C0_EPCOS.pdf; SIZE: 1812; UIR_MAX: 250mA; UKAT: I; ULS: 2x51,0uH; URDC: 2x550mOhm; UTERM: Au; UTMAX: 150°C; UTMIN: -55°C; UTOL: 30%; UTYP: Data And Signal Line Chokes; UVAC: 42.0V; UVAL: 2x51,0uH; UVCC_MAX: 250V (DC); UVDC: 80.0V
LED201 LED301 LED401 LED402 LED501 LED502 = led:LED: LED OSRAM: - CHIPLED LG R971, LG N971, LY N971, LG Q971, LY Q971, LO R971, LY R971 LH N974, LH R974 LS Q976, LO Q976, LY Q976 LO Q996 - Hyper CHIPLED LW Q18S LB Q993, LB Q99A, LB R99A - SideLED LS A670, LO A670, LY A670, LG A670, LP A670 LB A673, LV A673, LT A673, LW A673 LH A674 LY A675 LS A676, LA A676, LO A676, LY A676, LW A676 LS A679, LY A679, LG A679 - Hyper Micro SIDELED® LS Y876, LA Y876, LO Y876, LY Y876 LT Y87S - SmartLED LW L88C, LW L88S LB L89C, LB L89S, LG L890 LS L89K, LO L89K, LY L89K LS L896, LA L896, LO L896, LY L896 - TOPLED LS T670, LO T670, LY T670, LG T670, LP T670 LSG T670, LSP T670, LSY T670, LOP T670, LYG T670 LG T671, LOG T671, LSG T671 LB T673, LV T673, LT T673, LW T673 LH T674 LS T676, LA T676, LO T676, LY T676, LB T676, LH T676, LSB T676, LW T676 LB T67C, LV T67C, LT T67C, LS T67K, LO T67K, LY T67K, LW E67C LS E67B, LA E67B, LO E67B, LY E67B, LB E67C, LV E67C, LT E67C LW T67C LS T679, LY T679, LG T679 LS T770, LO T770, LY T770, LG T770, LP T770 LB T773, LV T773, LT T773, LW T773 LH T774 LS E675, LA E675, LY E675, LS T675 LS T776, LA T776, LO T776, LY T776, LB T776 LHGB T686 LT T68C, LB T68C - Hyper Mini TOPLED® LB M676 - Mini TOPLED Santana® LG M470 LS M47K, LO M47K, LY M47K Source: http://www.osram.convergy.de LUXEON: - LUMILED® LXK2-PW12-R00, LXK2-PW12-S00, LXK2-PW14-U00, LXK2-PW14-V00 LXK2-PM12-R00, LXK2-PM12-S00, LXK2-PM14-U00 LXK2-PE12-Q00, LXK2-PE12-R00, LXK2-PE12-S00, LXK2-PE14-T00, LXK2-PE14-U00 LXK2-PB12-K00, LXK2-PB12-L00, LXK2-PB12-M00, LXK2-PB14-N00, LXK2-PB14-P00, LXK2-PB14-Q00 LXK2-PR12-L00, LXK2-PR12-M00, LXK2-PR14-Q00, LXK2-PR14-R00 LXK2-PD12-Q00, LXK2-PD12-R00, LXK2-PD12-S00 LXK2-PH12-R00, LXK2-PH12-S00 LXK2-PL12-P00, LXK2-PL12-Q00, LXK2-PL12-R00 Source: www.luxeon.com KINGBRIGHT: KA-3528ASYC Source: www.kingbright.com
Q401 Q501 = 0_LES_CRYSTAL.SMD.XO:?*-T: Crystal Basic Serie - TXC Corporation Datasheet www Datasheet local Crystals Basics Serie - Frequenz: 1,5MHz...125MHz - Ta: -40°C...85°C max Range - deltaF/F0: 20/25/30/35/40/50/100ppm Revision Date changed by Changes ------------------------------------------------------------------------------------------ V1.0 26.10.2015 SC Ersterstellung; DISTRI_1: Digi-Key; DISTRI_1-NR: 887-1452-1-ND; DISTRI_1-PREIS: 0,73€; DISTRI_2: Mouser; DISTRI_2-NR: 717-7B-8.000MAAJ-T; DISTRI_2-PREIS: 0,815€; FREQ: 8,00MHz; HERSTELLER: TXC Corporation; HERSTELLER-NR: 7B-8.000MAAJ-T; PDF-LOCAL: file:///C:\Eagle-Datasheet\Crystals\7B_TXC.pdf; SIZE: 5,00mm x 3,20mm x 0,95mm; UBCAP: 18,0pF; UFDELTA: 30ppm; UTMIN: -20°C; UTOL: 30ppm; UTYP: XO-Norm; UT_MAX: 70°C; UVAL: 7B-8.000MAAJ-T
Q402 = foxBMS_BMS-Master_V1.00_A:MS3V
R201 R301 R401-R409 R501-R509 R701-R710 R901-R912 R1001-R1018 R1101-R1112 = rcl:R-EU_: RESISTOR, European symbol
R801-R806 R1401-R1408 R1501 R1502 = custom_passiv:R*: Widerstand: Bitte gleich beim Einfügen vorgesehenen Werkstoff wählen. 0R_0402: #2765 0R_0603: #2227 0R_0805: #2229 Met_0402: #2767 Met_0603: #801 Met_0805: #1095 Met_1206: #1389 Met_MINIMELF: #1683 MET_E96_0402: #2769 MET_E96_0603: #5 MET_E96_0805: #1230 MET_E96_1206: #286 MET_E96_MICROMELF: #1979 MET_E96_MINIMELF: #536
S401 S501 = 0_LES_SCHALTER-TASTER.SMD:KMR2: KMR2-Serie - C&K Components Datasheet www Datasheet local KMR2-Serie - Tactile - 4-Pin (4,60mm x 2,80mm x 1,90mm) Package - Long Life version - 4 actuation forces - Optional ground pin - Ultra low current capabilities - Excellent tactile feel - MAXIMUM POWER: 1 va 0.2 va - MAXIMUM VOLTAGE: 32 vDc 32 VDC - MINIMUM VOLTAGE: 20 mVDC 20 mVDC - MAXIMUM CURRENT: 50 mA 10 mA - MINIMUM CURRENT: 1 mA* 1 mA* - DIELECTRIC STRENGTH: ≥ 250 Vrms - CONTACT RESISTANCE: ≤ 100 mΩ - INSULATION RESISTANCE: ≥ 1GΩ - BOUNCE TIME: ≤ 3 ms - For ULC version minimum current is 1µA at 1.8 VDC Revision Date changed by Changes ------------------------------------------------------------------------------------------ V1.0 10.12.2015 SC Ersterstellung; DISTRI_1: Digi-Key; DISTRI_1-NR: 401-1426-1-ND; DISTRI_1-PREIS: 0,48€; DISTRI_2: Mouser; HERSTELLER: C&K Components; HERSTELLER-NR: KMR211GLFS; MARKING: -; PDF-LOCAL: file:///C:/Eagle-Datasheet/Schalter_Taster/KMR2_CK-Components.pdf; SIZE: 4,60mm x 2,80mm x 1,90mm; UKAT: I; UTERM: Sn; UTERMPLAT: Ag; UTMAX: 85°C; UTMIN: -40°C; UTYP: Tactile; UVAL: KMR211GLFS
SV501 = foxBMS_BMS-Master_BasicBoard_V1.02_A:MA06-2: PIN HEADER; OC_FARNELL: unknown; OC_NEWARK: unknown
SV901 SV1601 SV1603 SV2101 = foxBMS_BMS-Master_BasicBoard_V1.02_A:MA04-2: PIN HEADER; OC_FARNELL: unknown; OC_NEWARK: unknown
SV1602 SV1604 = foxBMS_BMS-Master_BasicBoard_V1.02_A:MA08-2: PIN HEADER; OC_FARNELL: unknown; OC_NEWARK: unknown
T401 T501 = 0_LES_TRANSISTOR.SMD.MOS.P-KANAL.NO:BSS84P: BSS84P - Infineon Datasheet www Datasheet local P-Kanal MOSFET - P-Channel - Enhancement mode - Logic Level - Avalanche rated - dv/dt rated - SOT23 (TO-236AB) Surface-Mounted Device (SMD) plastic package Revision Date changed by Changes ------------------------------------------------------------------------------------------ V1.0 01.01.2014 SC Ersterstellung; DISTRI_1: Farnell; DISTRI_1-NR: 1056526; DISTRI_1-PREIS: 0,06€; DISTRI_2: Mouser; DISTRI_2-NR: 726-BSS84PH6327; DISTRI_2-PREIS: 0,576€; HERSTELLER: Infineon; HERSTELLER-NR: BSS84P; MARKING: YBs; PDF-LOCAL: file:///C:\Eagle-Datasheet\Transistoren\BSS84P_Infineon.pdf; SIZE: SOT-23; UID: -170mA; URDS: 8,00Ohm; UTERM: Sn; UTMAX: 155°C; UTMIN: -55°C; UTYP: MOSFET; UVAL: BSS84P; UVDS: -60,0V; UVGS: 20,0V
T701 T801 T902 T903 T1001-T1006 = 0_LES_TRANSISTOR.SMD.MOS.N-KANAL.NO:IR?*: IR-Serie - International Rectifier IRFH5406TRPBF: Datasheet www Datasheet local IRLML0100TRPBF: Datasheet www Datasheet local HEXFET Power MOSFETs Revision Date changed by Changes ------------------------------------------------------------------------------------------ V1.0 01.01.2014 SC Erst. IRFH5406PBF V1.0 16.12.2015 SC Erst. IRLML0100TRPBF; DISTRI_1: Farnell; DISTRI_1-NR: 1783928; DISTRI_1-PREIS: 0,144€; DISTRI_2: Mouser; DISTRI_2-NR: 942-IRLML0100TRPBF; DISTRI_2-PREIS: 0,495€; HERSTELLER: International Rectifier; HERSTELLER-NR: IRLML0100TRPBF; MARKING: K; PDF-LOCAL: file:///C:\Eagle-Datasheet\Transistoren\IRLML0100PBF-1_IR.pdf; SIZE: SOT-23; UID: 1,60A; UTERM: Sn; UTMAX: 150°C; UTMIN: -55°C; UTYP: N-Channel MOSFET; UVAL: IRLML0100TRPBF; UVDS: 100V
T901 = 0_LES_TRANSISTOR.SMD.MOS.N-KANAL.NO:BUK?*: BUK9-Serie - Fairchild Semiconductor Datasheet www Datasheet local N-Channel Trench MOSFET - 3-Pin TO-263 /... Package - AEC Q101 compliant - Repetitive avalanche rated - Suitable for thermally demanding environments due to 175 °C rating - True logic level gate with VGS(th) rating of greater than 0.5V at 175 °C - 12 V Automotive systems - Motors, lamps and solenoid control - Start-Stop micro-hybrid applications - Transmission control - Ultra high performance power switching Revision Date changed by Changes ------------------------------------------------------------------------------------------ V1.0 15.12.2015 SC Ersterstellung; DISTRI_1: Farnell; DISTRI_1-NR: 2254205; DISTRI_1-PREIS: 0,968€; DISTRI_2: Digi-Key; DISTRI_2-NR: 568-9890-1-ND; DISTRI_2-PREIS: 1,86€; HERSTELLER: NXP; HERSTELLER-NR: BUK964R8-60E; MARKING: BUK964R8-60E; PDF-LOCAL: file:///C:\Eagle-Datasheet\Transistoren\BUK964R8-60E_NXP.pdf; SIZE: TO-263; UKAT: A; UPV: 234W; UTERM: Sn; UTMAX: 175°C; UTMIN: -55°C; UTYP: MOS N-Channel; UVAL: BUK964R8-60E; UVDSS: 60,0V; UVGSS: 5,00V
TP_GND_201 TP_GND_301 = wirepad:1,6/0,8: THROUGH-HOLE PAD
X201 = 0_LES_STECKVERBINDUNG.TH.RASTER_3,00MM.BUCHSE:43045-06?*_MOLEX_6PIN: 43045-Serie - MOLEX 43045-0600 Datasheet www Datasheet local 43045-0601 Datasheet www Datasheet local 43045-0602 Datasheet www Datasheet local - 6-Pin Buchse - liegend - Package - 2 reihig x 3-Pins - Size: 12,24mm x 12,65mm x 10,29mm - RM: 3,00mm - Farbe: Schwarz - Material: High Temperature Thermoplastic Revision Date changed by Changes ------------------------------------------------------------------------------------------ V1.0 20.04.2016 SC Ersterstellung; HERSTELLER: Molex; HERSTELLER-NR: 43045-0600; PDF-LOCAL: file:///C:\Eagle-Datasheet\Steckverbindung\430450600_Molex.pdf; SIZE: 12,24mm x 12,65mm x 10,29mm; UCOLOR: Schwarz; UIN_MAX: 5,00A; UKAT: C; UMAT: High Temperature Thermoplastic; URISO: 1,00GOhm; UTERM: Sn; UTERMPLAT: 254nm; UTMAX: 105°C; UTMIN: -40°C; UTYP: Buchse; UVAL: 43045-0600; UVCC_MAX: 600V
X401 = foxBMS_BMS-Master_BasicBoard_V1.02_A:MA03-1: PIN HEADER; OC_FARNELL: unknown; OC_NEWARK: unknown
X402 X501 X902 = foxBMS_BMS-Master_BasicBoard_V1.02_A:MA02-1: PIN HEADER
X403 X502 = 0_LES_STECKVERBINDUNG.SMD.RASTER_1,27MM.STECKER:SAMTEC_FTS_20POL_HEADER?_REV01: SAMTEC-FTS-20-Pin-Header stehend - ohne Verriegelung Datasheet www Datasheet local liegend - ohne Verriegelung Raster: 1,27mm Pinanzahl: 20 Ausführung: stehend / liegend Technologie: SMD Anschluss: Board-to-Board Icontakt: 3,30A Ta: -55°C...125°C Revision Date changed by Changes ------------------------------------------------------------------------------------------ V1.0 16.12.2015 SC Ersterstellung; DISTRI_1: Farnell; DISTRI_1-NR: 1667735; DISTRI_1-PREIS: 2,24€; DISTRI_2: Digi-Key; DISTRI_2-NR: SAM1159-10-ND; DISTRI_2-PREIS: 4,37€; HERSTELLER: SAMTEC; HERSTELLER-NR: FTS-110-03-L-DV; MARKING: -; PDF-LOCAL: file:///C:\Eagle-Datasheet\Steckverbindung\ERNI_234450.pdf; SIZE: 12,70mm x 6,10mm x 2,92mm; UCOL: Black; UIMAX: 3,30A; UKAT: I; UTERM: Sn; UTERMPLATE: Au; UTMAX: 125°C; UTMIN: -55°C; UTYP: Header; UVAL: FTS-110-03-L-DV
X701 X801 X1201-X1206 = 0_LES_STECKVERBINDUNG.TH.RASTER_3,00MM.BUCHSE:43045-04?*_MOLEX_4PIN: 43045-Serie - MOLEX 43045-0400 Datasheet www Datasheet local 43045-0401 Datasheet www Datasheet local 43045-0402 Datasheet www Datasheet local - 4-Pin Buchse - liegend - Package - 2 reihig x 2-Pins - Size: 12,24mm x 9,65mm x 10,29mm - RM: 3,00mm - Farbe: Schwarz - Material: High Temperature Thermoplastic Revision Date changed by Changes ------------------------------------------------------------------------------------------ V1.0 20.04.2016 SC Ersterstellung; DISTRI_1: Farnell; DISTRI_1-NR: 43045-0400; DISTRI_1-PREIS: 0,799€; DISTRI_2: Mouser; DISTRI_2-NR: 538-43045-0400; DISTRI_2-PREIS: 1,19€; HERSTELLER: Molex; HERSTELLER-NR: 43045-0400; PDF-LOCAL: file:///C:\Eagle-Datasheet\Steckverbindung\430450400_Molex.pdf; SIZE: 12,24mm x 9,65mm x 10,29mm; UCOLOR: Schwarz; UIN_MAX: 5,00A; UKAT: C; UMAT: High Temperature Thermoplastic; URISO: 1,00GOhm; UTERM: Sn; UTERMPLAT: 254nm; UTMAX: 105°C; UTMIN: -40°C; UTYP: Buchse; UVAL: 43045-0400; UVCC_MAX: 600V
X901 = 0_LES_STECKVERBINDUNG.TH.RASTER_3,00MM.BUCHSE:43045-02?*_MOLEX_2PIN: 43045-Serie - MOLEX 43045-0200 Datasheet www Datasheet local 43045-0201 Datasheet www Datasheet local 43045-0202 Datasheet www Datasheet local - 2-Pin Buchse - liegend - Package - 2 reihig x 1-Pin - Size: 15,40mm x 6,65mm x 10,29mm - RM: 3,00mm - Farbe: Schwarz - Material: High Temperature Thermoplastic Revision Date changed by Changes ------------------------------------------------------------------------------------------ V1.0 19.04.2016 SC Ersterstellung; DISTRI_1: Farnell; DISTRI_1-NR: 1012251; DISTRI_1-PREIS: 0,518€; DISTRI_2: Mouser; DISTRI_2-NR: 538-43045-0200; DISTRI_2-PREIS: 0,763€; HERSTELLER: Molex; HERSTELLER-NR: 43045-0200; PDF-LOCAL: file:///C:\Eagle-Datasheet\Steckverbindung\430450200_Molex.pdf; SIZE: 12,24mm x 6,65mm x 10,29mm; UCOLOR: Schwarz; UIN_MAX: 5,00A; UKAT: C; UMAT: High Temperature Thermoplastic; URISO: 1,00GOhm; UTERM: Sn; UTERMPLAT: 254nm; UTMAX: 105°C; UTMIN: -40°C; UTYP: Buchse; UVAL: 43045-0200; UVCC_MAX: 600V
X1401 X1402 = 0_LES_STECKVERBINDUNG.SMD.SPECIAL:MINI-USB-2.0: MINI-USB-2.0-BUCHSE - Multicomp Datasheet www Datasheet local Mini-USB-2.0 Typ AB - 5-PIN MINI-USB Typ AB - liegend - Package Revision Date changed by Changes ------------------------------------------------------------------------------------------ V1.0 10.12.2015 SC Ersterstellung; DISTRI_1: Farnell; DISTRI_1-NR: 1696539; DISTRI_1-PREIS: 0,51€; HERSTELLER: Multicomp; HERSTELLER-NR: MC32598; MARKING: -; PDF-LOCAL: file:///C:\Eagle-Datasheet\Steckverbindung\MC32598_Multicomp.pdf; SIZE: 9,90mm x 9,40mm x 4,00mm; UIB: 1,00A; UKAT: C; URDUR: 20,0mOhm; URISO: 1,00GOhm; UTERM: Sn; UTMAX: 105°C; UTMIN: -40°C; UTYP: mini USB Socket; UVAL: MC32598; UVB: 30,0V; UVPR: 750V
X1601 = 0_LES_STECKVERBINDUNG.TH.RASTER_3,00MM.BUCHSE:43045-16?*_MOLEX_16PIN: 43045-Serie - MOLEX 43045-1600 Datasheet www Datasheet local 43045-1601 Datasheet www Datasheet local 43045-1602 Datasheet www Datasheet local - 16-Pin Buchse - liegend - Package - 2 reihig x 8-Pins - Size: 12,24mm x 27,65mm x 10,29mm - RM: 3,00mm - Farbe: Schwarz - Material: High Temperature Thermoplastic Revision Date changed by Changes ------------------------------------------------------------------------------------------ V1.0 20.04.2016 SC Ersterstellung; HERSTELLER: Molex; HERSTELLER-NR: 43045-1600; PDF-LOCAL: file:///C:\Eagle-Datasheet\Steckverbindung\430451600_Molex.pdf; SIZE: 12,24mm x 27,65mm x 10,29mm; UCOLOR: Schwarz; UIN_MAX: 5,00A; UKAT: C; UMAT: High Temperature Thermoplastic; URISO: 1,00GOhm; UTERM: Sn; UTERMPLAT: 254nm; UTMAX: 105°C; UTMIN: -40°C; UTYP: Buchse; UVAL: 43045-1600; UVCC_MAX: 600V

## Net classes
0 default: width 0.152 mm, clearance 0.152 mm
1 controller: width 0.152 mm, clearance 0.152 mm to class 0, clearance 0.152 mm
3 USB: width 0.152 mm, clearance 0.203 mm to class 0, clearance 0.203 mm to class 1, clearance 0.203 mm to class 2, clearance 0.152 mm
4 Power: width 0.305 mm, clearance 0.152 mm to class 0, clearance 0.152 mm to class 1, clearance 0.152 mm to class 2, clearance 0.508 mm to class 3, clearance 0.152 mm